# Altium schematic sheet llrf_afe_epcq.SchDoc: =GlobalProjectName
size 209 x 297 mm; SheetNumber: Лист; SheetTotal: Листов; PageSetup: Record=PageOptions|CenterHorizontal=True|CenterVertical=True|PrintScale=1.00|XCorrection=1.00|YCorrection=1.00|PrintKind=1|BorderSize=5000000|LeftOffset=0|BottomOffset=0|Orientation=2|PaperLength=1000|PaperWidth=1000|Scale=100|PaperSource=15|PrintQuality=1200|MediaType=1|DitherType=10|PaperKind=A3|PrintScaleMode=1; Weight: -; ScaleFactor: -
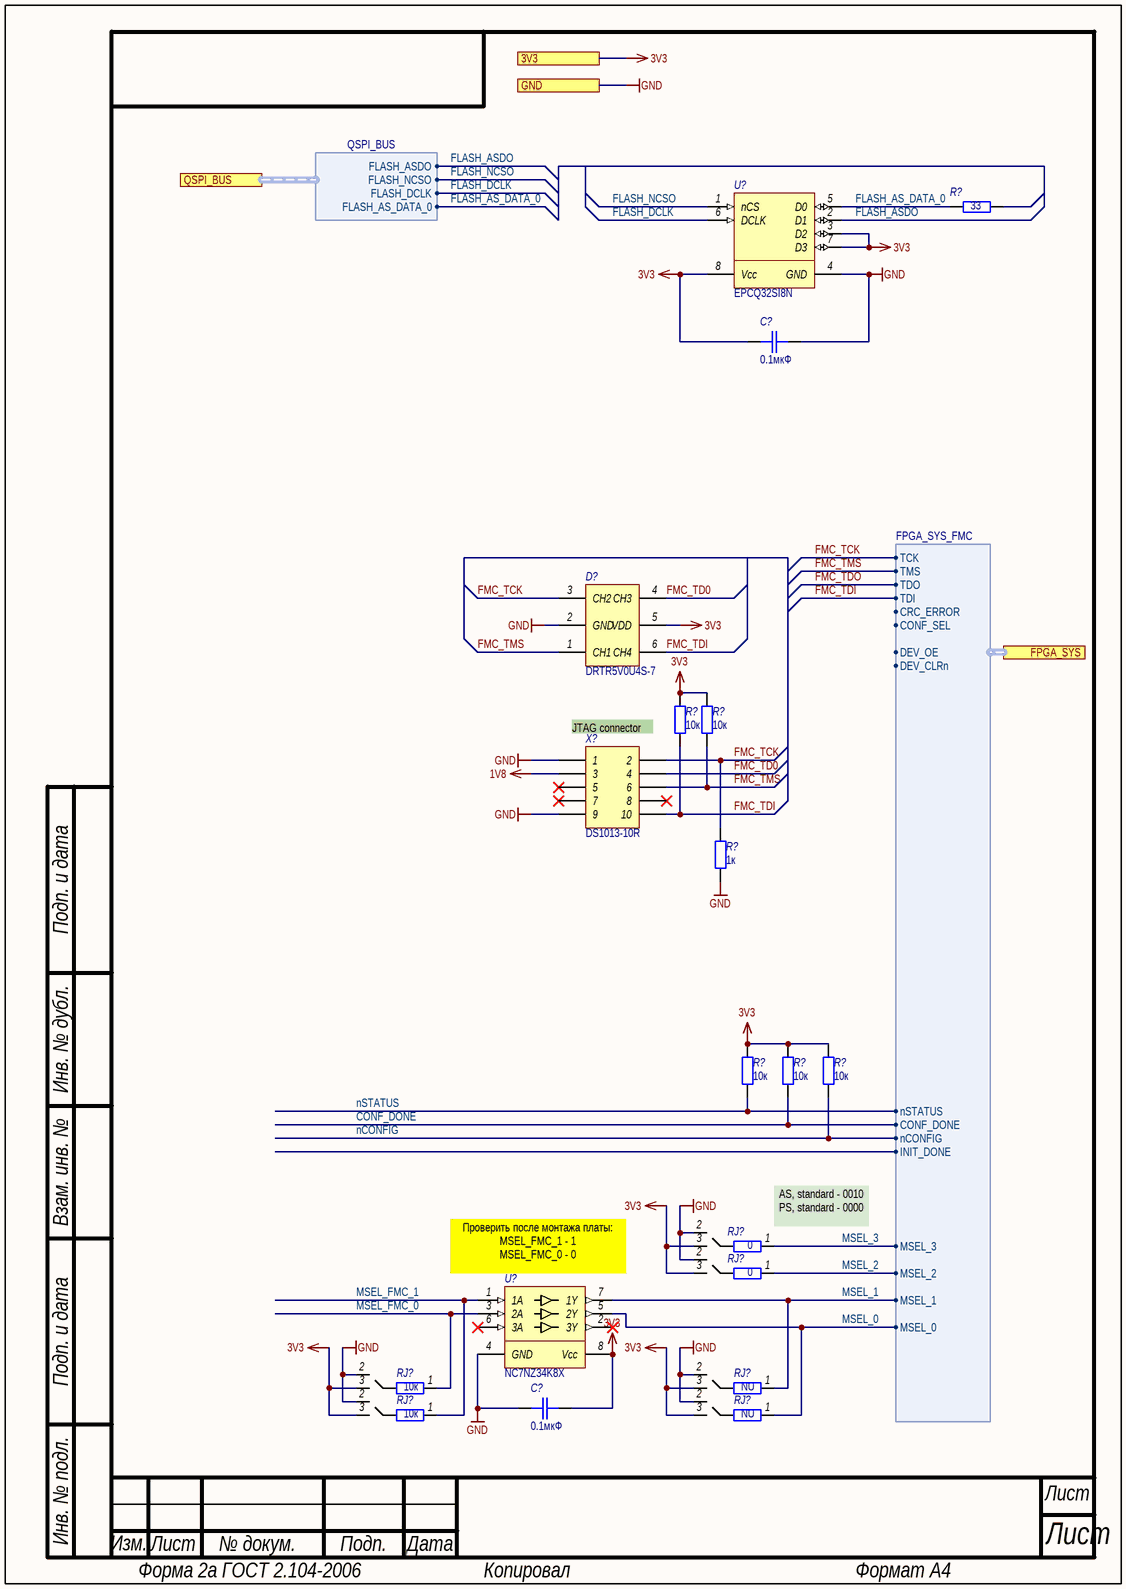
[diagram p0: llrf_afe_epcq.SchDoc]

## Parts
(Parts that share a designator on the sheet are numbered #1, #2 ... from top to bottom, then left to right.)
C?#1  0.1мкФ  [SMD_C0402]
C?#2  0.1мкФ  [SMD_C0402]
D?  Наименование: DRTR5V0U4S-7  [SOT-363]  (hidden comment: DRTR5V0U4S)
R?#1  33  [SMD_1206]
R?#2  10к  [SMD_0603]
R?#3  10к  [SMD_0603]
R?#4  1к  [SMD_0603]
R?#5  10к  [SMD_0603]
R?#6  10к  [SMD_0603]
R?#7  10к  [SMD_0603]
RJ?#1  0  [SMD_JMP_0603]
RJ?#2  0  [SMD_JMP_0603]
RJ?#3  10к  [SMD_JMP_0603]
RJ?#4  NU  [SMD_JMP_0603]
RJ?#5  10к  [SMD_JMP_0603]
RJ?#6  NU  [SMD_JMP_0603]
U?#1  EPCQ32SI8N  [SOIC-8]
U?#2  Наименование: NC7NZ34K8X  [US-8]  (hidden comment: NC7NZ34)
X?  Header 2X10  [DS1013-10R]  (value not drawn)

## Ports
3V3, FPGA_SYS (harness FPGA_SYS_FMC), GND, QSPI_BUS (harness QSPI_BUS)

## Harnesses
QSPI_BUS: FLASH_ASDO, FLASH_NCSO, FLASH_DCLK, FLASH_AS_DATA_0
FPGA_SYS_FMC: TCK, TMS, TDO, TDI, CRC_ERROR, CONF_SEL, INIT_DONE, DEV_OE, DEV_CLRn, nSTATUS, CONF_DONE, nCONFIG, MSEL_0, MSEL_1, MSEL_2, MSEL_3

## Nets
1V8: X?.3
3V3: C?#1.2 C?#2.2 D?.5(VDD) R?#2.2 R?#3.2 R?#5.2 R?#6.2 R?#7.2 RJ?#1.3 RJ?#2.3 RJ?#3.3 RJ?#4.3 RJ?#5.3 RJ?#6.3 U?#1.3(D2) U?#1.7(D3) U?#1.8(Vcc) U?#2.8(Vcc) ; port 3V3
GND: C?#1.1 C?#2.1 D?.2(GND) R?#4.1 RJ?#1.2 RJ?#2.2 RJ?#3.2 RJ?#4.2 RJ?#5.2 RJ?#6.2 U?#1.4(GND) U?#2.4(GND) X?.1 X?.9 ; port GND
CONF_DONE: R?#6.1 ; port FPGA_SYS.CONF_DONE
FLASH_AS_DATA_0: R?#1.2 U?#1.5(D0) ; port QSPI_BUS.FLASH_AS_DATA_0
FLASH_ASDO: U?#1.2(D1) ; port QSPI_BUS.FLASH_ASDO
FLASH_DCLK: U?#1.6(DCLK) ; port QSPI_BUS.FLASH_DCLK
FLASH_NCSO: U?#1.1(nCS) ; port QSPI_BUS.FLASH_NCSO
FMC_TCK: D?.3(СH2) R?#4.2 X?.2 ; port FPGA_SYS.TCK
FMC_TD0: D?.4(СH3) X?.4
FMC_TDI: D?.6(СH4) R?#2.1 X?.10 ; port FPGA_SYS.TDI
FMC_TDO: port FPGA_SYS.TDO
FMC_TMS: D?.1(СH1) R?#3.1 X?.6 ; port FPGA_SYS.TMS
MSEL_0: RJ?#6.1 U?#2.5(2Y) ; port FPGA_SYS.MSEL_0
MSEL_1: RJ?#4.1 U?#2.7(1Y) ; port FPGA_SYS.MSEL_1
MSEL_2: RJ?#2.1 ; port FPGA_SYS.MSEL_2
MSEL_3: RJ?#1.1 ; port FPGA_SYS.MSEL_3
MSEL_FMC_0: RJ?#3.1 U?#2.3(2A)
MSEL_FMC_1: RJ?#5.1 U?#2.1(1A)
nCONFIG: R?#7.1 ; port FPGA_SYS.nCONFIG
nSTATUS: R?#5.1 ; port FPGA_SYS.nSTATUS

Not connected (* = marked no-connect by the designer): R?#1 1; U?#2 2(3Y)* 6(3A)*; X? 5* 7* 8*

## Notes on the sheet
- JTAG connector
- (near U?#2) Проверить после монтажа платы:
  MSEL_FMC_1 - 1
  MSEL_FMC_0 - 0
- (near RJ?#1) AS, standard - 0010
  PS, standard - 0000
- Подп. и дата
- Инв. № дубл.
- Взам. инв. №
- Инв. № подл.
- Изм.
- Лист
- № докум.
- Подп.
- Дата
- Форма 2а ГОСТ 2.104-2006
- Копировал
- Формат А4

## Library data of the parts
C?#1 C?#2 = Capacitor: Назначение: SMD-конденсатор; Наименование: Конденсатор; Потребление, Вт: 0; Value: 0.1мкФ
D? = DRTR5V0U4S: 4 CHANNEL LOW CAPACITANCE TVS DIODE ARRAY; Потребление, Вт: 0.0; Назначение: 4 CHANNEL LOW CAPACITANCE TVS DIODE ARRAY; ComponentLink1Description: DataSheet; ComponentLink1URL: DRTR5V0U4S; Supplier 1: Digi-Key; Supplier Part Number 1: DRTR5V0U4S-7DICT-ND
R?#1 = Resistor: PE1206DRM470R01L; Назначение: SMD-резистор; Потребление, Вт: 0,001; Наименование: PE1206DRM470R01L; Value: 33
R?#2-R?#7 = Resistor: Наименование: Резистор; Назначение: SMD-резистор; Потребление, Вт: 0,001
  R?#2 R?#3 R?#5-R?#7: Value: 10к
  R?#4: Value: 1к
RJ?#1-RJ?#6 = Resistor_Jamper: Resistor-Jumper; Назначение: Резистор для выбора режима; Наименование: Резистор; Потребление, Вт: 0,0
  RJ?#1 RJ?#2: Value: 0
  RJ?#3 RJ?#5: Value: 10к
  RJ?#4 RJ?#6: Value: NU
U?#1 = EPCQ32SI8N: Programmable NOR flash memory; Потребление, Вт: 0.06; Назначение: Programmable NOR flash memory; ComponentLink1Description: DataSheet; ComponentLink1URL: https://www.intel.com/content/dam/www/programmable/us/en/pdfs/literature/hb/cfg/cfg_cf52014.pdf; Supplier 1: Mouser; Supplier Part Number 1: 989-EPCQ32SI8N; Наименование: EPCQ32SI8N
U?#2 = NC7NZ34: TinyLogic UHS Triple Buffer; Потребление, Вт: 0.01; Назначение: TinyLogic UHS Triple Buffer; ComponentLink1Description: DataSheet; ComponentLink1URL: https://www.onsemi.com/pdf/datasheet/nc7nz34-d.pdf; Supplier 1: Digi-Key; Supplier Part Number 1: NC7NZ34K8XCT-ND
X? = Header 2X10: BH-10R (DS1013-10R) (IDC-10MR), Вилка на плату угловая 10 конт. 2.54мм; Потребление, Вт: 0,0; Назначение: BH-10R (DS1013-10R) (IDC-10MR), Вилка на плату угловая 10 конт. 2.54мм; Наименование: DS1013-10R